# Altium project arm_control_board_2026.PrjPcb
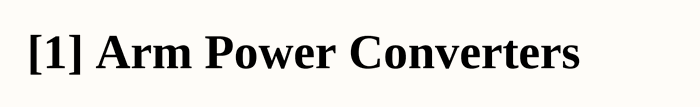
[diagram p0: 1_Power.SchDoc]
2 sheets, 22 parts. Net scope: global (net labels, ports and power ports of the same name join across sheets).
Sheets:
  1_Power.SchDoc
  2_MCU.SchDoc

## Sheet 1_Power.SchDoc
size A4; SheetNumber: 1; SheetTotal: 2

### Notes on the sheet
- [1] Arm Power Converters

## Sheet 2_MCU.SchDoc
size A4; SheetNumber: 2; SheetTotal: 2
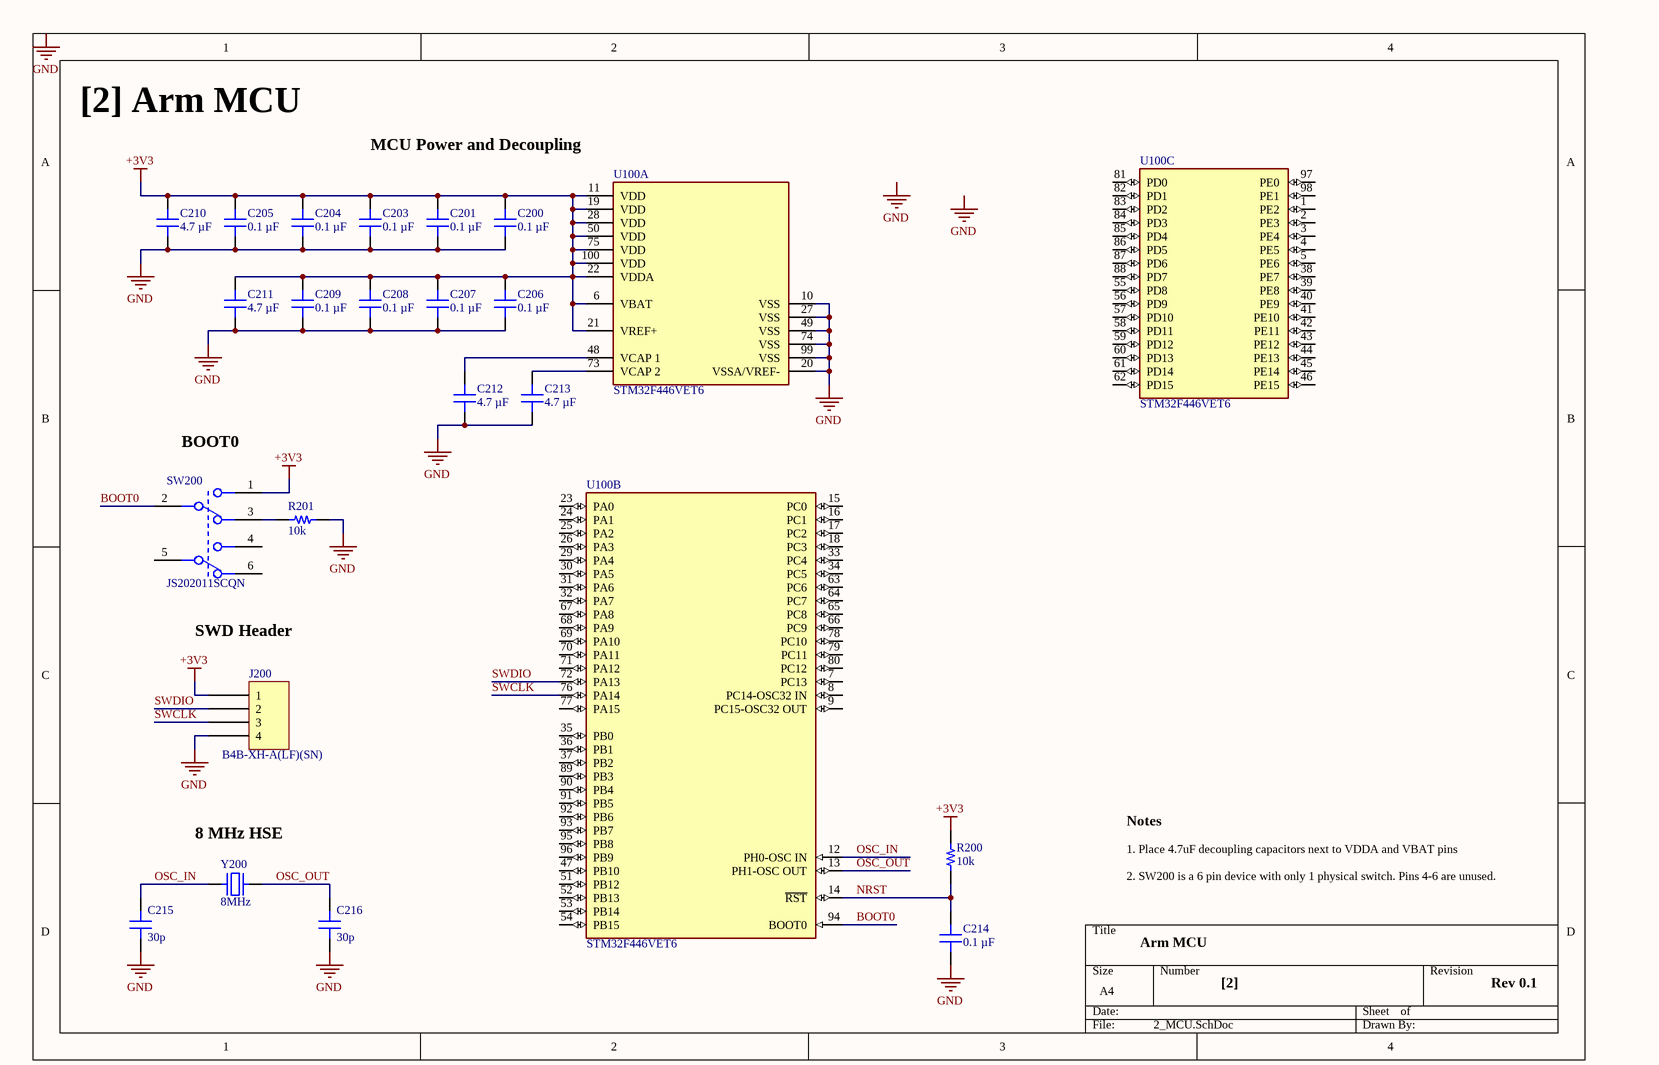
[diagram p1: 2_MCU.SchDoc]

### Parts
C200  0.1 µF  [CAP 0603_1608]
C201  0.1 µF  [CAP 0603_1608]
C203  0.1 µF  [CAP 0603_1608]
C204  0.1 µF  [CAP 0603_1608]
C205  0.1 µF  [CAP 0603_1608]
C206  0.1 µF  [CAP 0603_1608]
C207  0.1 µF  [CAP 0603_1608]
C208  0.1 µF  [CAP 0603_1608]
C209  0.1 µF  [CAP 0603_1608]
C210  4.7 µF  [CAP 0805_2012]
C211  4.7 µF  [CAP 0805_2012]
C212  4.7 µF  [CAP 0805_2012]
C213  4.7 µF  [CAP 0805_2012]
C214  0.1 µF  [CAP 0603_1608]
C215  30p  [CAP 0603_1608]
C216  30p  [CAP 0603_1608]
J200  B4B-XH-A(LF)(SN)  [JST XH B4B-XH-A]
R200  10k  [RES 0603_1608]
R201  10k  [RES 0603_1608]
SW200  JS202011SCQN  [FP-JS202011SCQN-MFG]
U100  STM32F446VET6  [FP-LQFP100-1L-MFG]  (parts A,B,C of 3)
Y200  8MHz  [TXC 9C]

### Nets
+3V3: C200.2 C201.2 C203.2 C204.2 C205.2 C206.2 C207.2 C208.2 C209.2 C210.2 C211.2 J200.1 R200.2 SW200.1 U100.6(VBAT) U100.11(VDD) U100.19(VDD) U100.21(VREF+) U100.22(VDDA) U100.28(VDD) U100.50(VDD) U100.75(VDD) U100.100(VDD)
GND: C200.1 C201.1 C203.1 C204.1 C205.1 C206.1 C207.1 C208.1 C209.1 C210.1 C211.1 C212.1 C213.1 C214.1 C215.1 C216.1 J200.4 R201.1 U100.10(VSS) U100.20(VSSA/VREF-) U100.27(VSS) U100.49(VSS) U100.74(VSS) U100.99(VSS)
BOOT0: SW200.2 U100.94(BOOT0)
NRST: C214.2 R200.1 U100.14(~{RST})
OSC_IN: C215.2 U100.12(PH0-OSC_IN) Y200.1
OSC_OUT: C216.2 U100.13(PH1-OSC_OUT) Y200.2
SWCLK: J200.3 U100.76(PA14)
SWDIO: J200.2 U100.72(PA13)
NetC212_2: C212.2 U100.48(VCAP_1)
NetC213_2: C213.2 U100.73(VCAP_2)
NetR201_2: R201.2 SW200.3

Not connected (* = marked no-connect by the designer): SW200 4 5 6; U100 1(PE2) 2(PE3) 3(PE4) 4(PE5) 5(PE6) 7(PC13) 8(PC14-OSC32_IN) 9(PC15-OSC32_OUT) 15(PC0) 16(PC1) 17(PC2) 18(PC3) 23(PA0) 24(PA1) 25(PA2) 26(PA3) 29(PA4) 30(PA5) 31(PA6) 32(PA7) 33(PC4) 34(PC5) 35(PB0) 36(PB1) 37(PB2) 38(PE7) 39(PE8) 40(PE9) 41(PE10) 42(PE11) 43(PE12) 44(PE13) 45(PE14) 46(PE15) 47(PB10) 51(PB12) 52(PB13) 53(PB14) 54(PB15) 55(PD8) 56(PD9) 57(PD10) 58(PD11) 59(PD12) 60(PD13) 61(PD14) 62(PD15) 63(PC6) 64(PC7) 65(PC8) 66(PC9) 67(PA8) 68(PA9) 69(PA10) 70(PA11) 71(PA12) 77(PA15) 78(PC10) 79(PC11) 80(PC12) 81(PD0) 82(PD1) 83(PD2) 84(PD3) 85(PD4) 86(PD5) 87(PD6) 88(PD7) 89(PB3) 90(PB4) 91(PB5) 92(PB6) 93(PB7) 95(PB8) 96(PB9) 97(PE0) 98(PE1)

### Notes on the sheet
- [2] Arm MCU
- MCU Power and Decoupling
- (near SW200) BOOT0
- SWD Header
- (near Y200) 8 MHz HSE
- Notes
- 1. Place 4.7uF decoupling capacitors next to VDDA and VBAT pins
- 2. SW200 is a 6 pin device with only 1 physical switch. Pins 4-6 are unused.
- Arm MCU
- [2]
- Rev 0.1
- Labels drawn without touching a wire or pin: GND

### Library data of the parts
C200 C201 C203-C209 C214 = C0603C104K5RAC7411: CAP CER 0.1UF 50V X7R 0603; manufacturer: KEMET; Tolerance: ±10%; Part Number: C0603C104K5RAC7411; Capacitance: 0.1 µF; Applications: Bypass, Decoupling; componentlink1description: Datasheet; componentlink1url: https://api.kemet.com/component-edge/download/datasheet/C0603C104K5RAC7411.pdf; componentlink2description: DigiKey Link; componentlink2url: https://www.digikey.com/en/products/detail/kemet/C0603C104K5RAC7411/3317013; Device Package: 0603 (1608 Metric); lastupdated: 2024-02-09 8:10:30 PM; Lifecycle Status: Active; Minimum Order: 1; Mounting Type: Surface Mount, MLCC; Operating Temperature: -55°C ~ 125°C; Package / Case: 0603 (1608 Metric); packaging: TapeAndReel; partid: 2233; Part Status: Active; price: 0.01; series: SMD Comm X7R; Size / Dimension: 0.063" L x 0.031" W (1.60mm x 0.80mm); Supplier 1: DigiKey; Supplier Part Number 1: 399-C0603C104K5RAC7411CT-ND; Temperature Coefficient: X7R; Thickness (Max): 0.035" (0.90mm); value: 0.1 µF; Voltage - Rated: 50V
C210-C213 = C0805X475M3RACAUTO: CAP CER 4.7UF 25V X7R 0805; manufacturer: KEMET; Tolerance: ±20%; Part Number: C0805X475M3RACAUTO; Capacitance: 4.7 µF; Applications: Automotive, Boardflex Sensitive; componentlink1description: Datasheet; componentlink1url: https://connect.kemet.com:7667/gateway/IntelliData-ComponentDocumentation/1.0/download/datasheet/C0805X475M3RACAUTO; componentlink2description: DigiKey Link; componentlink2url: https://www.digikey.com/en/products/detail/kemet/C0805X475M3RACAUTO/11676617; Device Package: 0805 (2012 Metric); Features: Soft Termination; lastupdated: 2024-02-09 8:14:57 PM; Lifecycle Status: Active; Minimum Order: 1; Mounting Type: Surface Mount, MLCC; Operating Temperature: -55°C ~ 125°C; Package / Case: 0805 (2012 Metric); packaging: TapeAndReel; partid: 46017; Part Status: Active; price: 0.15; Ratings: AEC-Q200; series: SMD Auto X7R Flex; Size / Dimension: 0.079" L x 0.049" W (2.00mm x 1.25mm); Supplier 1: DigiKey; Supplier Part Number 1: 399-C0805X475M3RACAUTOCT-ND; Temperature Coefficient: X7R; Thickness (Max): 0.057" (1.45mm); value: 4.7 µF; Voltage - Rated: 25V
C215 C216 = CC0603GRNPO9BN300: CAP CER 30PF 50V C0G/NPO 0603; manufacturer: Yageo; Temperature Coefficient: C0G, NP0; Tolerance: ±2%; Part Number: CC0603GRNPO9BN300; Value: 30p; Applications: General Purpose; Capacitance: 30 pF; componentlink1description: Datasheet; componentlink1url: https://www.yageo.com/upload/media/product/productsearch/datasheet/mlcc/UPY-GP_NP0_16V-to-50V_17.pdf; componentlink2description: DigiKey Link; componentlink2url: https://www.digikey.com/en/products/detail/yageo/CC0603GRNPO9BN300/5883556; Device Package: 0603 (1608 Metric); lastupdated: 2024-02-09 8:10:30 PM; Lifecycle Status: Active; Minimum Order: 1; Mounting Type: Surface Mount, MLCC; Operating Temperature: -55°C ~ 125°C; Package / Case: 0603 (1608 Metric); packaging: TapeAndReel; partid: 2313; Part Status: Active; price: 0.01; series: CC; Size / Dimension: 0.063" L x 0.031" W (1.60mm x 0.80mm); Supplier 1: DigiKey; Supplier Part Number 1: 311-3352-1-ND; Thickness (Max): 0.035" (0.90mm); Voltage - Rated: 50V
J200 = B4B-XH-A(LF)(SN): CONN HEADER VERT 4POS 2.5MM; Manufacturer: JST Sales America Inc.; Contact Length - Post: 0.134" (3.40mm); Current Rating (Amps): 3A; Material Flammability Rating: UL94 V-0; Number of Positions: 4; Number of Positions Loaded: All; Pitch - Mating: 0.098" (2.50mm); Shrouding: Shrouded - 4 Wall; Style: Board to Cable/Wire; Voltage Rating: 250V; Part Number: B4B-XH-A(LF)(SN); ComponentLink1Description: Datasheet; ComponentLink1URL: http://www.jst-mfg.com/product/pdf/eng/eXH.pdf; ComponentLink2Description: DigiKey Link; ComponentLink2URL: http://digikey.com/product-detail/en/jst-sales-america-inc/B4B-XH-A-LF-SN/455-2249-ND/1651047; Connector Type: Header; Contact Finish - Mating: Tin; Contact Finish - Post: Tin; Contact Material: Brass; Contact Shape: Square; Contact Type: Male Pin; Fastening Type: Detent Lock; Insulation Color: Natural; Insulation Height: 0.276" (7.00mm); Insulation Material: Polyamide (PA66), Nylon 6/6; LastUpdated: 2020-01-12 11:46:34 PM; Lifecycle Status: Active; Minimum Order: 1; Mounting Type: Through Hole; Number of Rows: 1; Operating Temperature: -25°C ~ 85°C; Packaging: Bulk; PartId: 69; Part Status: Active; Price: 0.21; Series: XH; Supplier 1: DigiKey; Supplier Part Number 1: 455-2249-ND; Termination: Press-Fit, Solder
R200 R201 = RNCS0603BKE10K0: RES 10K OHM 0.1% 1/16W 0603; Manufacturer: Stackpole Electronics Inc; Power (Watts): 0.063W, 1/16W; Resistance: 10 kOhms; Temperature Coefficient: ±25ppm/°C; Part Number: RNCS0603BKE10K0; Value: 10k; ComponentLink1Description: Datasheet; ComponentLink1URL: https://www.seielect.com/catalog/sei-rncs_rnch.pdf; ComponentLink2Description: DigiKey Link; ComponentLink2URL: https://www.digikey.com/en/products/detail/stackpole-electronics-inc/RNCS0603BKE10K0/1708836; Composition: Thin Film; Device Package: 0603 (1608 Metric); Features: Anti-Corrosive, Automotive AEC-Q200, Moisture Resistant; Height - Seated (Max): 0.022" (0.55mm); LastUpdated: 2024-02-09 8:43:37 PM; Lifecycle Status: Active; Minimum Order: 1; Number of Terminations: 2; Operating Temperature: -55°C ~ 155°C; Package / Case: 0603 (1608 Metric); Packaging: TapeAndReel; PartId: 4838; Part Status: Active; Price: 0.06; Ratings: AEC-Q200; Series: RNCS; Size / Dimension: 0.061" L x 0.031" W (1.55mm x 0.80mm); Supplier 1: DigiKey; Supplier Part Number 1: RNCS0603BKE10K0CT-ND; Supplier Device Package: 0603; Tolerance: ±0.1%
SW200 = CMP-2000-05087-3: SWITCH SLIDE DPDT 300MA 6V; Switch Function: On-On; Actuator Type: Standard; Switch Travel: 2mm; Actuator Color: Black; Contact Resistance: 70mR; Electrical Life: 5000Cycles; Actuator Material: Nylon; REACH SVHC: No SVHC; Series: JS; Min Operating Temperature: -20°C; Depth: 7.5mm; Housing Material: Nylon; Voltage Rating (DC): 6V; Max Operating Temperature: 85°C; Contact Current Rating: 300mA; Package Quantity: 1; Contact Plating: Silver; Contact Material: Copper Alloy; Throw Configuration: DPDT; Current Rating: 300mA; Orientation: Vertical; Max Current Rating: 300mA; Max Voltage Rating (DC): 6V; Flammability Rating: UL94 V-2; Length: 9mm; Packaging: Tape and Reel; Mount: Surface Mount; Actuator Length: 2mm; Lead Free: Lead Free; Termination: Gull Wing; Radiation Hardening: No
U100 = CMP-12105-000075-1: IC MCU 32BIT 512KB FLASH 100LQFP; Manufacturer: STMicroelectronics; Ram Size: 128KBytes; Data Bus Width: 32bits; Max Junction Temp: +125°C; Number Of Adc Channels: 16; Max Supply Voltage: 3.6V; Nominal Supply Current: 1.4-86mA; Number Of Uart Channels: 6; Core Architecture: ARM Cortex-M4; Standoff Height: 0.05mm; Number Of A/D Converters: 3; Frequency: 180MHz; Number Of Cores: 1; Min Supply Voltage: 1.65V; Number Of Timers/Counters: 14; Number Of Usb Channels: 2; Number Of Spi Channels: 4; Interface: I2C,SPI,UART,USART,Parallel,CAN,USB,LIN,IrDA,I2S,Other; Memory Size: 512KBytes; Number Of I/Os: 81; Ambient Temperature Range High: +85°C; Mouser Description: ARM Microcontrollers - MCU High-performance and DSP with FPU, ARM Cortex-M4 MCU with 512 Kbytes Flash, 180 MHz CPU, Art Accelerator, SDRAM; Device Class L2: Embedded Processors and Controllers; Temperature Range Low: -40°C; Device Class L1: Integrated Circuits (ICs); RoHS: TRUE; Ipc Land Pattern Name: QFP50P1600X1600X160-100; Manufacturer Part Number: STM32F446VET6; Octopart: https://octopart.com/stm32f446vet6-stmicroelectronics-52642922; Package: LQFP100-1L; Automotive: No; Category: IC; ComponentLink2URL: https://www.st.com/resource/en/datasheet/stm32f446ve.pdf; Digikey Description: IC MCU 32BIT 512KB FLASH 100LQFP; Temperature Range High: +85°C; Memory Type: FLASH; Lead Free: Yes; Height: 1.6mm; ComponentLink2Description: Datasheet; Number Of I2C Channels: 4; Device Class L3: Microcontrollers; Temperature: -40°C to +85°C; Ambient Temperature Range Low: -40°C
Y200 = 9C-8.000MBBK-T: CRYSTAL 8.0000MHZ 20PF SMD; Manufacturer: TXC CORPORATION; ESR (Equivalent Series Resistance): 80 Ohms; Frequency Stability: ±50ppm; Operating Mode: Fundamental; Part Number: 9C-8.000MBBK-T; ComponentLink1Description: Datasheet; ComponentLink1URL: http://www.txccorp.com/download/products/quartz_crystals/2015TXC_9C_32.pdf; ComponentLink2Description: DigiKey Link; ComponentLink2URL: http://digikey.com/product-detail/en/txc-corporation/9C-8.000MBBK-T/887-2475-1-ND/4475454; Frequency: 8MHz; Frequency Tolerance: ±50ppm; Height - Seated (Max): 0.161" (4.10mm); LastUpdated: 6/3/2024 8:02:24 PM; Lifecycle Status: Active; Load Capacitance: 20pF; Minimum Order: 1; Mounting Type: Surface Mount; Operating Temperature: -20°C ~ 70°C; Package / Case: HC-49S; Packaging: TapeAndReel; PartId: 697; Part Status: Active; Price: 0.18; Series: 9C; Size / Dimension: 0.449" L x 0.189" W (11.40mm x 4.80mm); Supplier 1: DigiKey; Supplier Part Number 1: 887-2475-1-ND; Type: MHz Crystal; Value: 8MHz